# EAGLE schematic box (EAGLE 7.5.0)
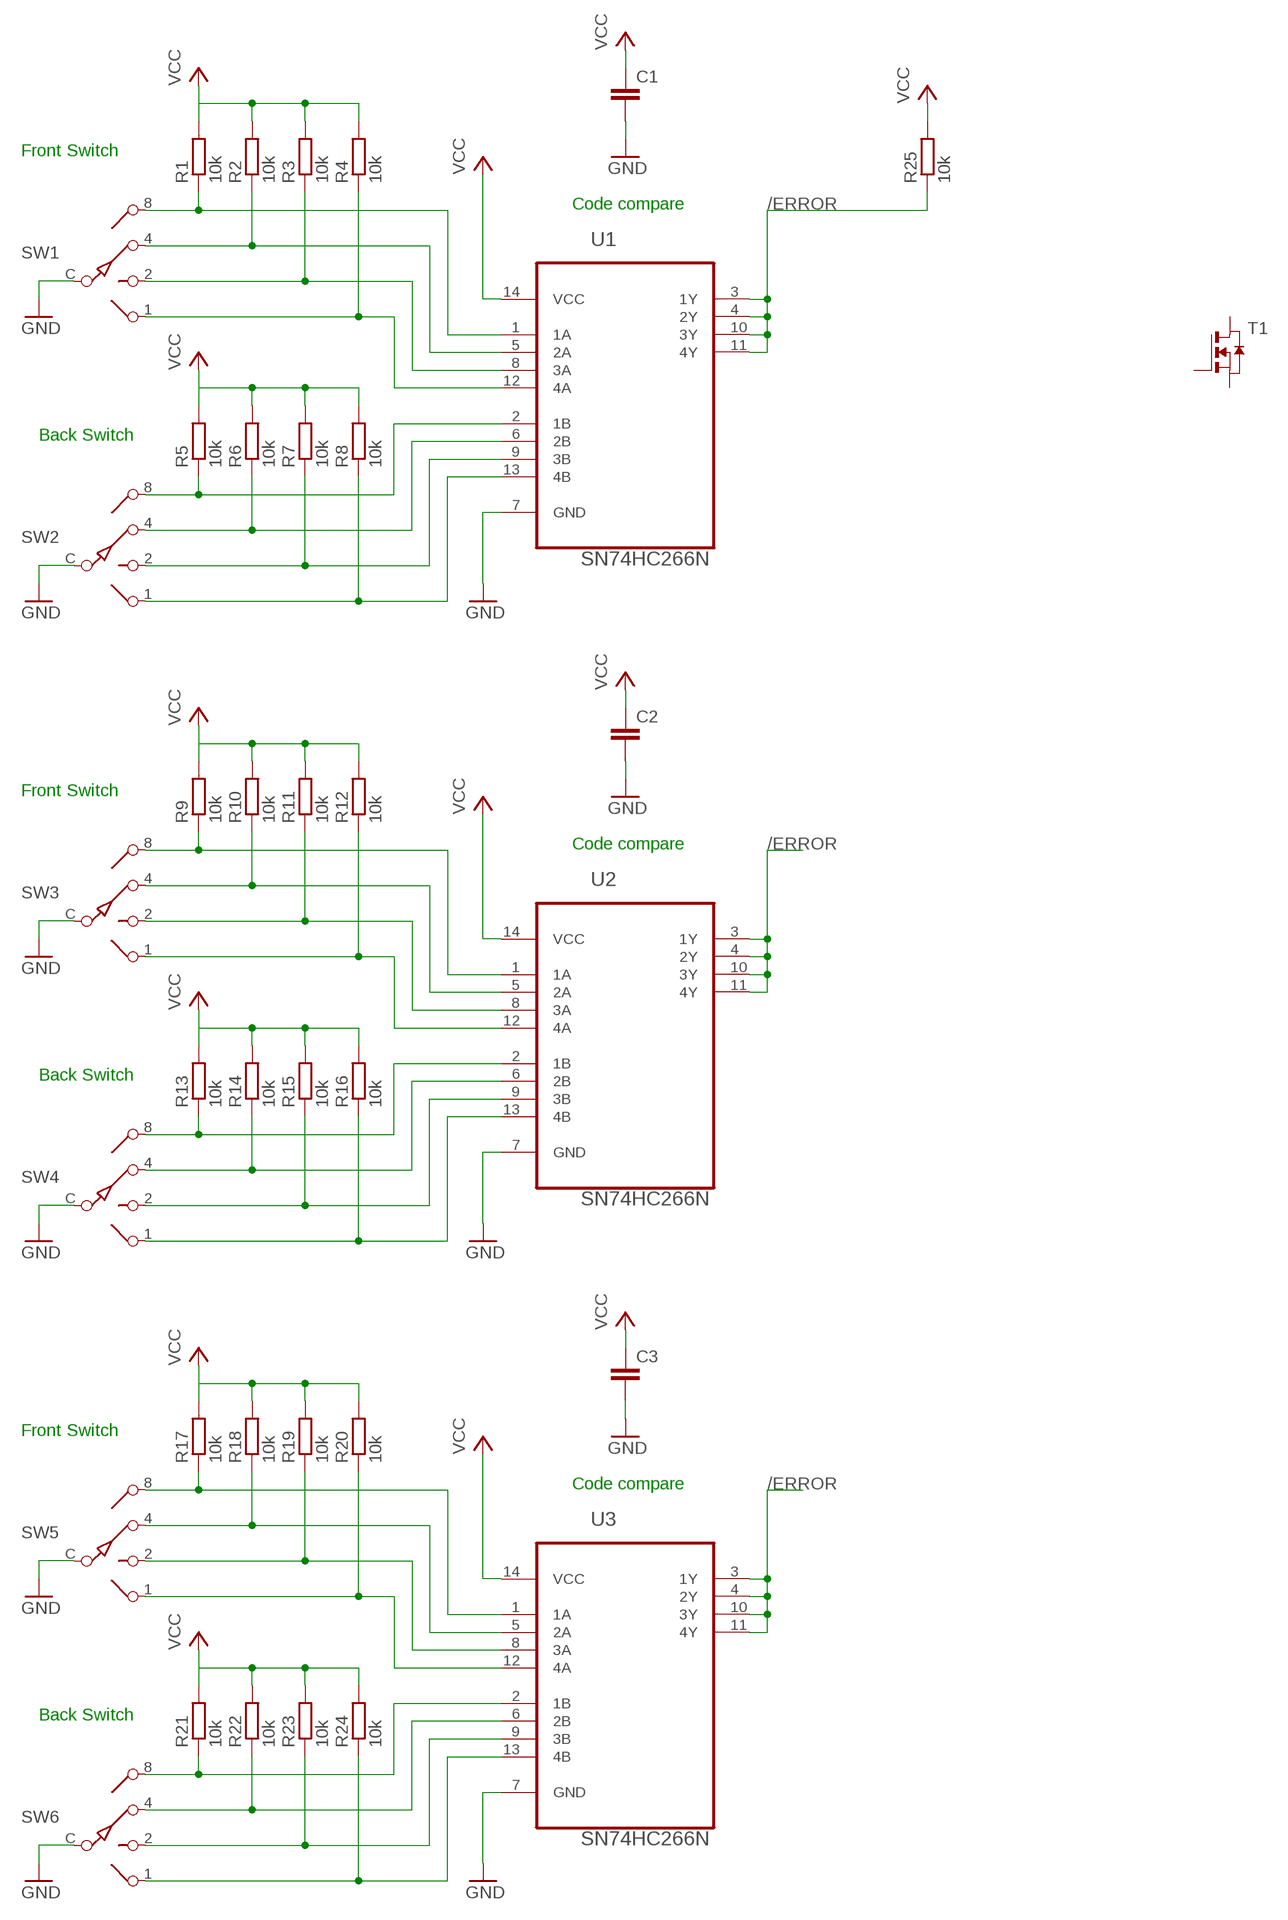
[diagram p0: schematic, sheet 1]

## Parts
C1  C-EUC0805  [C0805]
C2  C-EUC0805  [C0805]
C3  C-EUC0805  [C0805]
R1  10k  R-EU_R0805  [R0805]
R2  10k  R-EU_R0805  [R0805]
R3  10k  R-EU_R0805  [R0805]
R4  10k  R-EU_R0805  [R0805]
R5  10k  R-EU_R0805  [R0805]
R6  10k  R-EU_R0805  [R0805]
R7  10k  R-EU_R0805  [R0805]
R8  10k  R-EU_R0805  [R0805]
R9  10k  R-EU_R0805  [R0805]
R10  10k  R-EU_R0805  [R0805]
R11  10k  R-EU_R0805  [R0805]
R12  10k  R-EU_R0805  [R0805]
R13  10k  R-EU_R0805  [R0805]
R14  10k  R-EU_R0805  [R0805]
R15  10k  R-EU_R0805  [R0805]
R16  10k  R-EU_R0805  [R0805]
R17  10k  R-EU_R0805  [R0805]
R18  10k  R-EU_R0805  [R0805]
R19  10k  R-EU_R0805  [R0805]
R20  10k  R-EU_R0805  [R0805]
R21  10k  R-EU_R0805  [R0805]
R22  10k  R-EU_R0805  [R0805]
R23  10k  R-EU_R0805  [R0805]
R24  10k  R-EU_R0805  [R0805]
R25  10k  R-EU_R0805  [R0805]
SW1  ROTARY-SWITCH-10POSMCRM4HAF-10R-V-B  [MCRM4HAF]
SW2  ROTARY-SWITCH-10POSMCRM4HAF-10R-V-B  [MCRM4HAF]
SW3  ROTARY-SWITCH-10POSMCRM4HAF-10R-V-B  [MCRM4HAF]
SW4  ROTARY-SWITCH-10POSMCRM4HAF-10R-V-B  [MCRM4HAF]
SW5  ROTARY-SWITCH-10POSMCRM4HAF-10R-V-B  [MCRM4HAF]
SW6  ROTARY-SWITCH-10POSMCRM4HAF-10R-V-B  [MCRM4HAF]
T1  TSM3442  [SOT23-6]
U1  SN74HC266N  [DIP254P762X508-14]
U2  SN74HC266N  [DIP254P762X508-14]
U3  SN74HC266N  [DIP254P762X508-14]

## Nets
/ERROR: R25.1 U1.3(1Y) U1.4(2Y) U1.10(3Y) U1.11(4Y) U2.3(1Y) U2.4(2Y) U2.10(3Y) U2.11(4Y) U3.3(1Y) U3.4(2Y) U3.10(3Y) U3.11(4Y)
GND: C1.2 C2.2 C3.2 SW1.C SW2.C SW3.C SW4.C SW5.C SW6.C U1.7(GND) U2.7(GND) U3.7(GND)
N$1: R1.1 SW1.8 U1.1(1A)
N$2: R2.1 SW1.4 U1.5(2A)
N$3: R3.1 SW1.2 U1.8(3A)
N$4: R4.1 SW1.1 U1.12(4A)
N$5: R9.1 SW3.8 U2.1(1A)
N$6: R5.1 SW2.8 U1.2(1B)
N$7: R6.1 SW2.4 U1.6(2B)
N$8: R7.1 SW2.2 U1.9(3B)
N$9: R8.1 SW2.1 U1.13(4B)
N$10: R10.1 SW3.4 U2.5(2A)
N$11: R11.1 SW3.2 U2.8(3A)
N$12: R12.1 SW3.1 U2.12(4A)
N$13: R13.1 SW4.8 U2.2(1B)
N$14: R14.1 SW4.4 U2.6(2B)
N$15: R15.1 SW4.2 U2.9(3B)
N$16: R16.1 SW4.1 U2.13(4B)
N$17: R17.1 SW5.8 U3.1(1A)
N$18: R18.1 SW5.4 U3.5(2A)
N$19: R19.1 SW5.2 U3.8(3A)
N$20: R20.1 SW5.1 U3.12(4A)
N$21: R21.1 SW6.8 U3.2(1B)
N$22: R22.1 SW6.4 U3.6(2B)
N$23: R23.1 SW6.2 U3.9(3B)
N$24: R24.1 SW6.1 U3.13(4B)
VCC: C1.1 C2.1 C3.1 R1.2 R2.2 R3.2 R4.2 R5.2 R6.2 R7.2 R8.2 R9.2 R10.2 R11.2 R12.2 R13.2 R14.2 R15.2 R16.2 R17.2 R18.2 R19.2 R20.2 R21.2 R22.2 R23.2 R24.2 R25.2 U1.14(VCC) U2.14(VCC) U3.14(VCC)
Unconnected: T1.1(D) T1.2(D) T1.3(G) T1.4(S) T1.5(D) T1.6(D)

## Notes on the sheet
- Front Switch
- Code compare
- Back Switch
- Front Switch
- Code compare
- Back Switch
- Front Switch
- Code compare
- Back Switch

## Library data of the parts
C1-C3 = rcl:C-EU: CAPACITOR, European symbol
R1-R25 = resistor:R-EU_: RESISTOR, European symbol
SW1-SW6 = fabBox:ROTARY-SWITCH-10POS: SWITCH 10-step rotary switch
T1 = fabBox:TSM3442: 20V N-Channel MOSFET 4A Farnell <http://ch.farnell.com/fr-CH/taiwan-semiconductor/tsm3442cx6/mosfet-n-ch-20v-4a-sot26/dp/1864591>; OC_FARNELL: unknown; OC_NEWARK: unknown
U1-U3 = fabBox:SN74HC266N: QUAD 2-IN EXCLUSIVE -NOR GATES; MPN: SN74HC266N; OC_FARNELL: 1607817; OC_NEWARK: 08F6495; PACKAGE: 14-DIP; SUPPLIER: Texas Instruments